# Altium schematic sheet NNP-DWG-165-001-000 BP2 Network Interface Pg 4 of 6.SchDoc
size 431 x 279 mm; Organization: ORGANIZATION; Address1: ADDRESS 1; Address2: ADDRESS 2; Address3: ADDRESS 3; Address4: ADDRESS 4; Revision: -; SheetNumber: 5; SheetTotal: 6; ENG_APP_DATE: --/--/--; DSN_APP_DATE: --/--/--; CHK_APP_DATE: --/--/--
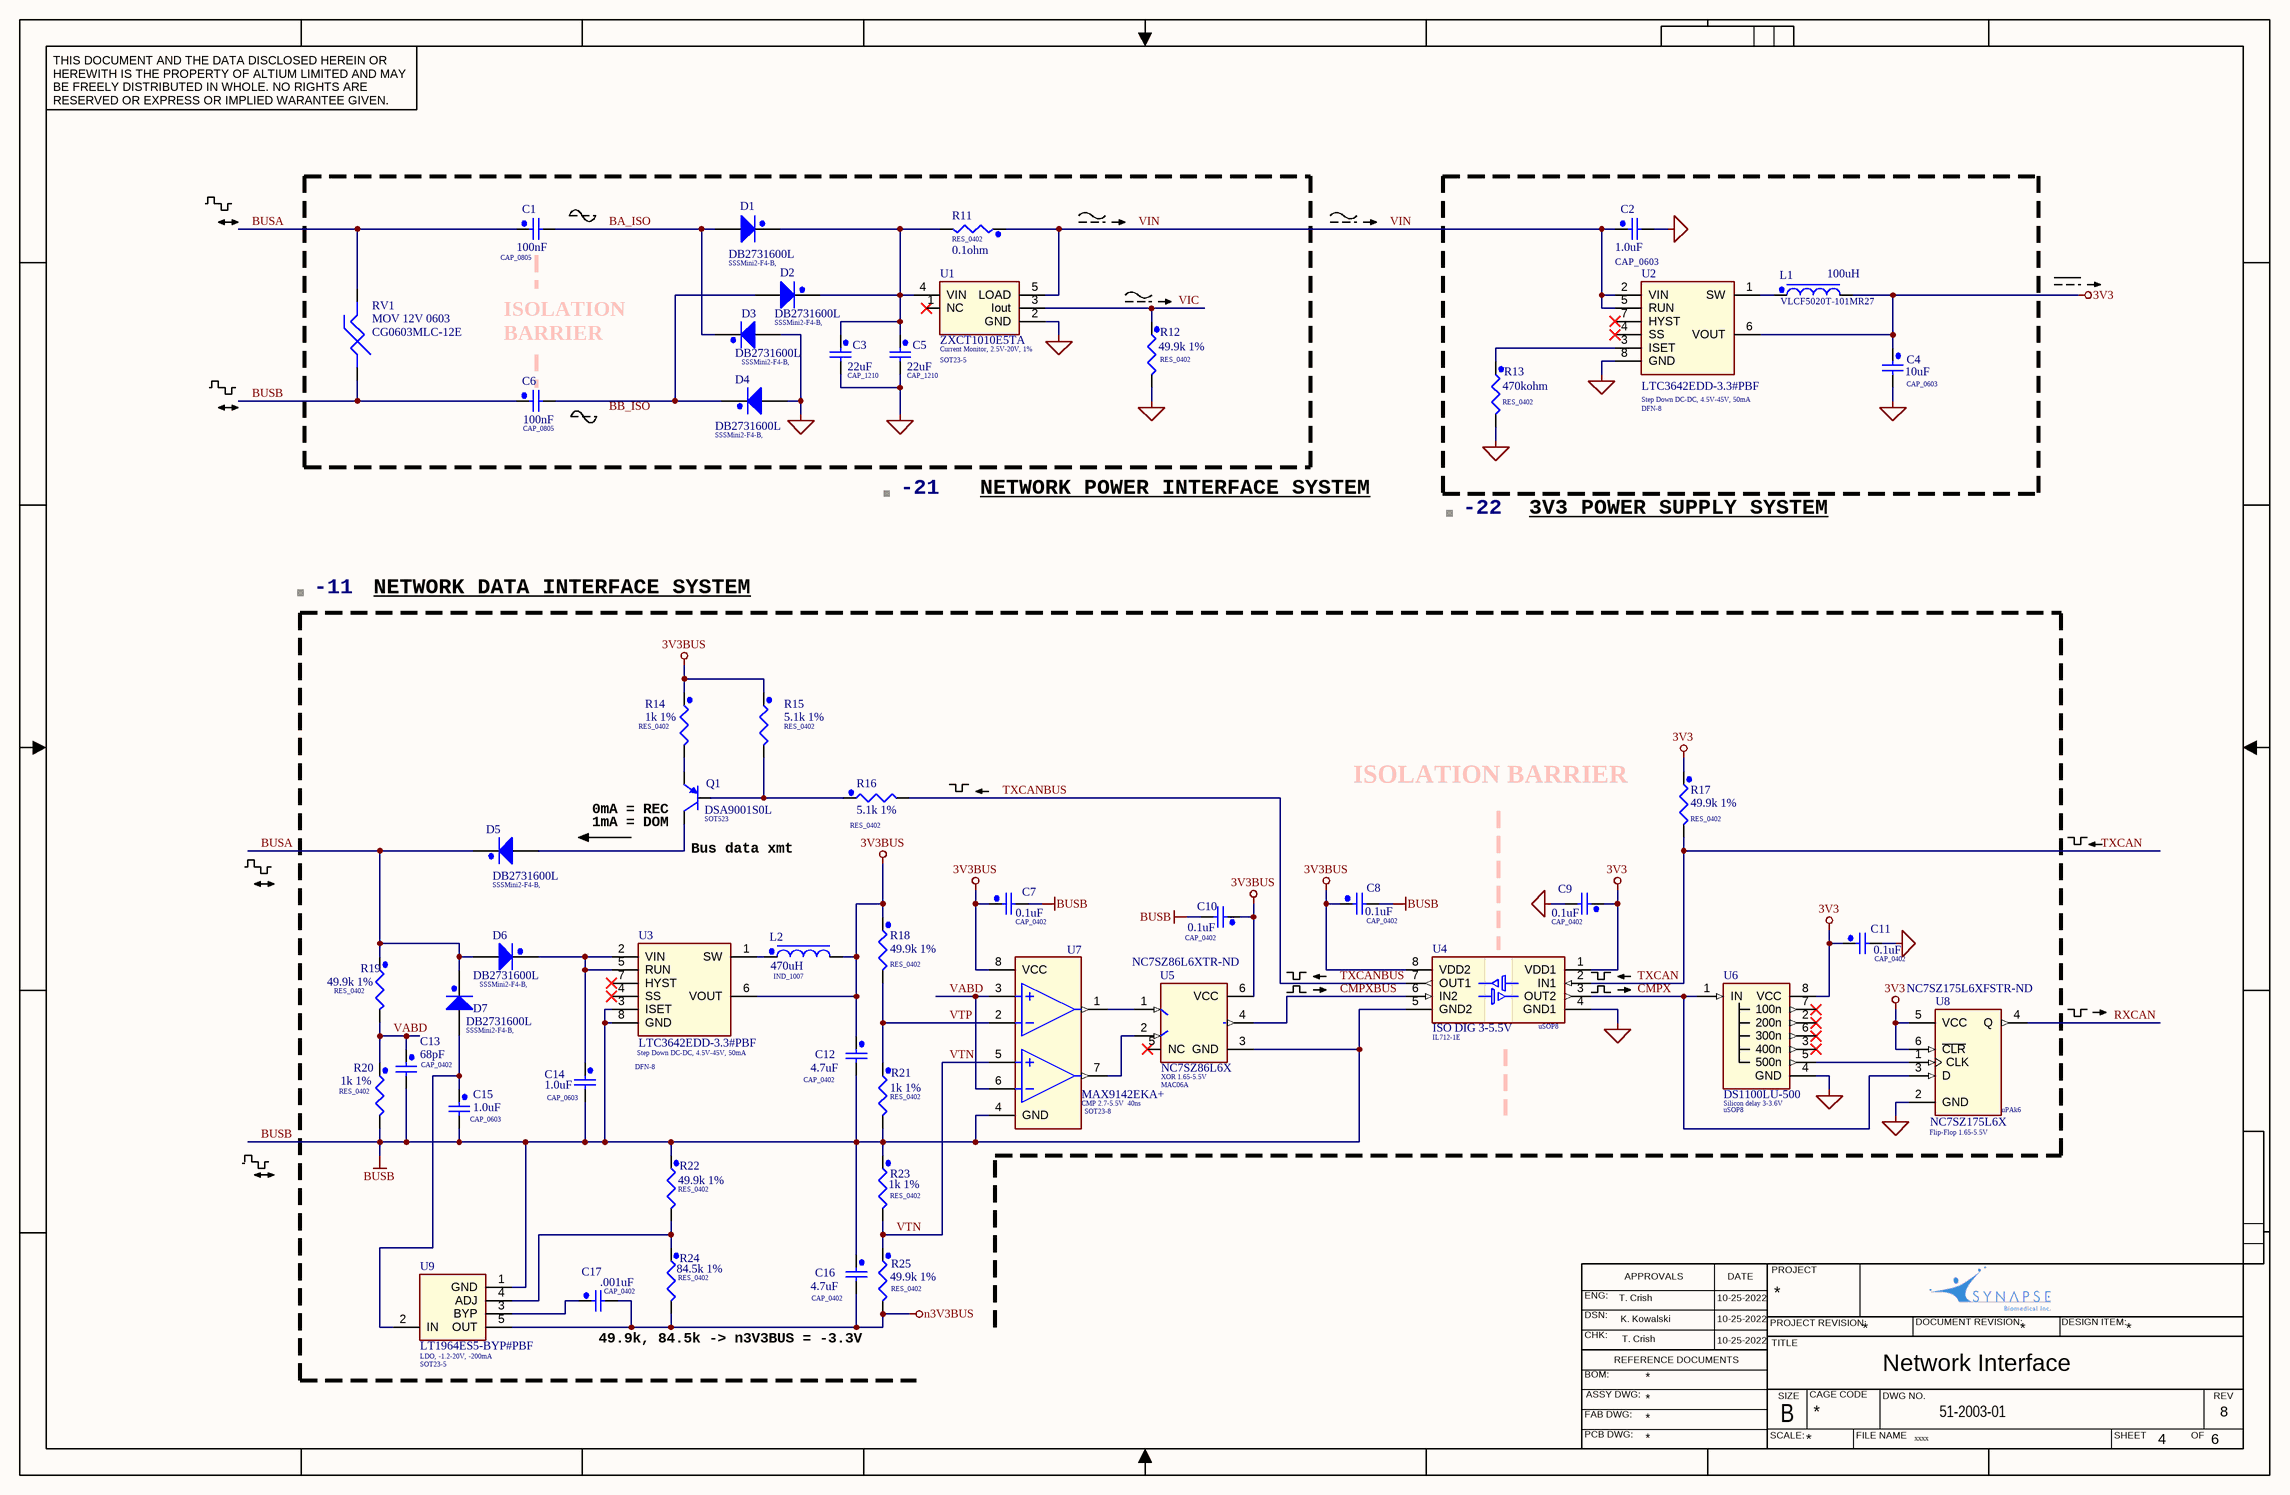
[diagram p0: NNP-DWG-165-001-000 BP2 Network Interface Pg 4 of 6.SchDoc]

## Parts
-11  XDESCRIPTION: NETWORK DATA INTERFACE SYSTEM  (hidden comment: BOM_S1)  (graphical)
-21  XDESCRIPTION: NETWORK POWER INTERFACE SYSTEM  (hidden comment: BOM_S1)  (graphical)
-22  XDESCRIPTION: 3V3 POWER SUPPLY SYSTEM  (hidden comment: BOM_S1)  (graphical)
C1  value 100nF  [CAP_0805]  (hidden comment: C_100n_X7R_100_0805_10%)
C2  value 1.0uF  [CAP_0603]  (hidden comment: C_1u_X7R_25_0603_10%)
C3  value 22uF  PackageDescription: CAP_1210  [CHIP_1210N]  (hidden comment: C_47u_X5R_16_1210_20%)
C4  value 10uF  [CAP_0603]  (hidden comment: C_10u_X5R_6V3_0603_20%)
C5  value 22uF  PackageDescription: CAP_1210  [CHIP_1210N]  (hidden comment: C_47u_X5R_16_1210_20%)
C6  value 100nF  [CAP_0805]  (hidden comment: C_100n_X7R_100_0805_10%)
C7  value 0.1uF  [CAP_0402]  (hidden comment: C_100n_X7R_16_0402_10%)
C8  value 0.1uF  [CAP_0402]  (hidden comment: C_100n_X7R_16_0402_10%)
C9  value 0.1uF  [CAP_0402]  (hidden comment: C_100n_X7R_16_0402_10%)
C10  value 0.1uF  [CAP_0402]  (hidden comment: C_100n_X7R_16_0402_10%)
C11  value 0.1uF  [CAP_0402]  (hidden comment: C_100n_X7R_16_0402_10%)
C12  value 4.7uF  [CAP_0402]  (hidden comment: C_4u7_X5R_6V3_0402_20%)
C13  value 68pF  [CAP_0402]  (hidden comment: C_68p_C0G_50_0402_5%)
C14  value 1.0uF  [CAP_0603]  (hidden comment: C_1u_X7R_25_0603_10%)
C15  value 1.0uF  [CAP_0603]  (hidden comment: C_1u_X7R_25_0603_10%)
C16  value 4.7uF  [CAP_0402]  (hidden comment: C_4u7_X5R_6V3_0402_20%)
C17  value .001uF  [CAP_0402]  (hidden comment: C_10n_X7R_50_0402_20%)
D1  value DB2731600L  PackageDescription: SSSMini2-F4-B,  [SSSMini2-F4-B]  (hidden comment: Schotty Diode, 30V, 100mA, RoHS)
D2  value DB2731600L  PackageDescription: SSSMini2-F4-B,  [SSSMini2-F4-B]  (hidden comment: Schotty Diode, 30V, 100mA, RoHS)
D3  value DB2731600L  PackageDescription: SSSMini2-F4-B,  [SSSMini2-F4-B]  (hidden comment: Schotty Diode, 30V, 100mA, RoHS)
D4  value DB2731600L  PackageDescription: SSSMini2-F4-B,  [SSSMini2-F4-B]  (hidden comment: Schotty Diode, 30V, 100mA, RoHS)
D5  value DB2731600L  PackageDescription: SSSMini2-F4-B,  [SSSMini2-F4-B]  (hidden comment: Schotty Diode, 30V, 100mA, RoHS)
D6  value DB2731600L  PackageDescription: SSSMini2-F4-B,  [SSSMini2-F4-B]  (hidden comment: Schotty Diode, 30V, 100mA, RoHS)
D7  value DB2731600L  PackageDescription: SSSMini2-F4-B,  [SSSMini2-F4-B]  (hidden comment: Schotty Diode, 30V, 100mA, RoHS)
L1  value 100uH  [IND LPS4414 COILCRAFT]  (hidden comment: L_100u, 270mA, 20%, RoHS)
L2  value 470uH  [IND_1007]  (hidden comment: 470uH, 35mH, 10%, 10 ohm)
Q1  value DSA9001S0L  [SOT523]  (hidden comment: Q_-50_-100m_SOT523)
R11  value 0.1ohm  [RES_0402]  (hidden comment: R_100m_0402)
R12  value 49.9k 1%  [RES_0402]  (hidden comment: R_49k9_0402)
R13  value 470kohm  [RES_0402]  (hidden comment: R_470k_0402)
R14  value 1k 1%  [RES_0402]  (hidden comment: R_1k_0402)
R15  value 5.1k 1%  [RES_0402]  (hidden comment: R_5k1_0402)
R16  value 5.1k 1%  [RES_0402]  (hidden comment: R_5k1_0402)
R17  value 49.9k 1%  [RES_0402]  (hidden comment: R_49k9_0402)
R18  value 49.9k 1%  [RES_0402]  (hidden comment: R_49k9_0402)
R19  value 49.9k 1%  [RES_0402]  (hidden comment: R_49k9_0402)
R20  value 1k 1%  [RES_0402]  (hidden comment: R_1k_0402)
R21  value 1k 1%  [RES_0402]  (hidden comment: R_1k_0402)
R22  value 49.9k 1%  [RES_0402]  (hidden comment: R_49k9_0402)
R23  value 1k 1%  [RES_0402]  (hidden comment: R_1k_0402)
R24  value 84.5k 1%  [RES_0402]  (hidden comment: R_84k5_0402)
R25  value 49.9k 1%  [RES_0402]  (hidden comment: R_49k9_0402)
RV1  MOV 12V 0603  [RES_0603]
U1  Current Monitor, 2.5V-20V, 1%  [SOT23-5]
U2  Step Down DC-DC, 4.5V-45V, 50mA  PackageDescription: DFN-8  MPN: LTC3642EDD-3.3#PBF  [DFN8]
U3  Step Down DC-DC, 4.5V-45V, 50mA  PackageDescription: DFN-8  MPN: LTC3642EDD-3.3#PBF  [DFN8]
U4  ISO DIG 3-5.5V  PackageDescription: uSOP8  [MSOP-8L]
U5  XOR 1.65-5.5V  PackageDescription: MAC06A  Supplier Part Number 1: NC7SZ86L6XTR-ND  [uPak6]
U6  Silicon delay 3-3.6V  PackageDescription: uSOP8  [MSOP-8L]
U7  CMP 2.7-5.5V  40ns  MPN: MAX9142EKA+  [SOT23-8]
U8  Flip-Flop 1.65-5.5V  Supplier Part Number 1: NC7SZ175L6XFSTR-ND  [uPak6]
U9  LDO, -1.2-20V, -200mA  MPN: LT1964ES5-BYP#PBF  [SOT23-5]

## Nets
3V3: C4.1 C9.1 C11.1 L1.2 R17.1 U2.6(VOUT) U4.1(VDD1) U6.8(VCC) U8.5(VCC) U8.6(~{CLR})
3V3BUS: C7.1 C8.1 C10.1 C12.1 L2.2 R14.1 R15.1 R18.1 U3.6(VOUT) U4.8(VDD2) U5.6(VCC) U7.8(VCC)
BUSB: C6.1 C7.2 C8.2 C10.2 C12.2 C13.2 C14.2 C15.2 C16.1 R20.2 R21.2 R22.1 R23.1 RV1.2(P) U3.3(ISET) U3.8(GND) U4.5(GND2) U5.3(GND) U7.4(GND) U9.1(GND)
GND: C2.2 C3.2 C4.2 C5.2 C9.2 C11.2 D3.2(A) D4.2(A) R12.2 R13.2 U1.2(GND) U2.8(GND) U4.4(GND1) U6.4(GND) U8.2(GND)
n3V3BUS: C16.2 C17.2 R24.2 R25.2 U9.5(OUT)
BA_ISO: C1.2 D1.2(A) D3.1(C)
BUSA: C1.1 D5.1(C) D6.2(A) D7.1(C) R19.1 RV1.1(P)
CMPX: U4.3(OUT2) U6.1(IN) U8.3(D)
CMPXBUS: U4.6(IN2) U5.4(O)
RXCAN: U8.4(Q)
TXCAN: R17.2 U4.2(IN1)
TXCANBUS: R16.2 U4.7(OUT1)
VABD: C13.1 R19.2 R20.1 U7.3(INA+) U7.6(INB-)
VIC: R12.1 U1.3(Iout)
VIN: C2.1 R11.1 U1.5(LOAD) U2.2(VIN) U2.5(RUN)
VTN: R23.2 R25.1 U7.5(INB+)
VTP: R18.2 R21.1 U7.2(INA-)
NetC3_1: C3.1 C5.1 D1.1(C) D2.1(C) R11.2 U1.4(VIN)
NetC6_2: C6.2 D2.2(A) D4.1(C)
NetC14_1: C14.1 D6.1(C) U3.2(VIN) U3.5(RUN)
NetC15_1: C15.1 D7.2(A) U9.2(IN)
NetC17_1: C17.1 U9.3(BYP)
NetD5_2: D5.2(A) Q1.3(C)
NetL1_1: L1.1 U2.1(SW)
NetL2_1: L2.1 U3.1(SW)
NetQ1_1: Q1.1(B) R15.2 R16.1
NetQ1_2: Q1.2(E) R14.2
NetR13_1: R13.1 U2.3(ISET)
NetR22_2: R22.2 R24.1 U9.4(ADJ)
NetU5_1: U5.1(A) U7.1(OUTA)
NetU5_2: U5.2(B) U7.7(OUTB)
NetU6_5: U6.5(500n) U8.1(CLK)

Not connected (* = marked no-connect by the designer): U1 1(NC)*; U2 4(SS)* 7(HYST)*; U3 4(SS)* 7(HYST)*; U5 5(NC)*; U6 2(200n)* 3(400n)* 6(300n)* 7(100n)*

## Notes on the sheet
- THIS DOCUMENT AND THE DATA DISCLOSED HEREIN OR HEREWITH IS THE PROPERTY OF ALTIUM LIMITED AND MAY BE FREELY DISTRIBUTED IN WHOLE. NO RIGHTS ARE RESERVED OR EXPRESS OR IMPLIED WARANTEE GIVEN.
- ISOLATION
  BARRIER
- (near Q1) 0mA = REC
- (near Q1) 1mA = DOM
- ISOLATION BARRIER
- (near Q1) Bus data xmt
- ENG:
- T. Crish
- APPROVALS
- 10-25-2022
- DATE
- PROJECT
- 49.9k, 84.5k -> n3V3BUS = -3.3V
- DSN:
- CHK:
- REFERENCE DOCUMENTS
- K. Kowalski
- PROJECT REVISION:
- TITLE
- *
- DOCUMENT REVISION:
- Network Interface
- DESIGN ITEM:
- BOM:
- FAB DWG:
- PCB DWG:
- ASSY DWG:
- SCALE:
- SIZE
- B
- CAGE CODE
- FILE NAME
- DWG NO.
- 51-2003-01
- SHEET
- OF
- REV
- 8
- xxxx
- 4
- 6
- Labels drawn without touching a wire or pin: BB_ISO

## Library data of the parts
-11 -21 -22 = BOM_S1: BOM item small graphic
C1 C6 = 08051C104KAZ2A: 0.1uF, 100V, X7R, 0805, 10%, RoHS; MFR: Murata Electronics North America; MPN: GRM155R71C104KA88D; SBI: xx-xxxx; PackageDescription: CAP_0805; Supplier 1: Digi-Key; Supplier Part Number 1: 490-3261-6-ND
C2 C14 = GRM188R71E105KA12D: 1.0uF, 25V, X7R, 0603, 10%, RoHs; MFR: TDK Corp; MPN: CGA3E1X7R1C105K080AC; SBI: 53-0067; PackageDescription: CAP_0603; Supplier 1: Digi-Key; Supplier Part Number 1: 445-12539
C3 C5 = GRM32ER61C476ME15L: 22uF, 16V, X5R, 1210, 20%, RoHS; MFR: Samsung Electro-Mechanics America; MPN: CL32A226MOTLNNE; SBI: 53-0099; Supplier 1: Digi-Key; Supplier Part Number 1: 1276-6757-1-ND
C4 = ECJ-1VB0J106M: 10uF, 6.3V, X5R, 0603_20%, RoHS; MFR: Murata Electronics North America; SBI: 53-0039; PackageDescription: CAP_0603; Supplier 1: Digi-Key; Supplier Part Number 1: 490-6405-6-ND; MPN: GRM188R60J106ME47J
C7-C11 = GRM155R71C104KA88D: 0.1uF, 16V, X7R, 0402, RoHS; MFR: Murata Electronics North America; SBI: 53-0040; PackageDescription: CAP_0402; Supplier 1: Digi-Key; Supplier Part Number 1: 490-3261-6-ND; MPN: GRM155R71C104KA88D
C12 C16 = ECJ-0EB0J475M: 4.7uF, 6.3V, X5R, 20%, 0402, RoHS; MFR: Murata Electronics North America; MPN: GRM155R60J475ME47D; SBI: 53-0042; VTPN: CC6470-MJA06R16; PackageDescription: CAP_0402; Supplier 1: Digi-Key; Supplier Part Number 1: 490-5915-6-ND
C13 = GRM1555C1H680JZ01D: 68pF, 50V, C0G, 0402, 5%, RoHS; MFR: Murata Electronics  North America; MPN: GRM1555C1H680JA01D; SBI: 53-0041-1; PackageDescription: CAP_0402; Supplier 1: Digi-Key; Supplier Part Number 1: 490-5876-6-ND
C15 = GRM188R71E105KA12D: 1.0uF, 25V, X7R, 0603, 10%, RoHs; MFR: TDK Corp; MPN: CGA3E1X7R1C105K080AC; PackageDescription: CAP_0603; Supplier 1: Digi-Key; Supplier Part Number 1: 445-12539
C17 = C0402C103M5RACTU: 0.001uF, 50V, X7R, 20%, 0402, RoHS; MFR: Murata Electronics North America; MPN: GJM1555C1H1R0BB01D; SBI: 53-0043; VTPN: CC4100-MJX50RC7; PackageDescription: CAP_0402; Supplier 1: Digi-Key; Supplier Part Number 1: 490-6073-6-ND
D1-D7 = DB27316: MFR: Panasonic Electronic Components; SBI: 54-0075; Supplier 1: Digi-Key; Supplier Part Number 1: DB2731600LDKR-ND; MPN: DB2731600L
L1 = VLCF5020T-101MR27: MFR: TDK Corporation; SBI: 53-0032; MPN: VLCF5020T-101MR27; Supplier 1: Digi-Key; Supplier Part Number 1: 445-3203-6-ND
L2 = CB2518T471K: 470uH, 35mA, 10%, RoHS; MFR: Taiyo Yuden; SBI: 55-0033; VTPN: IS5470-K000RC7; Supplier 1: Digi-Key; PackageDescription: IND_1007; Supplier Part Number 1: 587-2194-6-ND; MPN: CB2518T471K
Q1 = DSA9001: PNP, -50V, -100mA, SOT523, 150MHz, RoHS; MFR: Panasonic; SBI: 54-0050; VTPN: TSDSA900-S0RC7; PackageDescription: SOT523; Supplier 1: Digi-Key; Supplier Part Number 1: DSA9001S0LDKR-ND; MPN: DSA9001S0L
R11 = RP1005S-R10-F: 0.1 ohm, 1%, 1/16W, 0402, RoHS; MFR: Susumu; SBI: 53-0049-2; PackageDescription: RES_0402; Supplier 1: Digi-Key; Supplier Part Number 1: RP10S.10FCT-ND; MPN: RP1005S-R10-F
R12 R17-R19 R25 = MCR01MZPF4992: 49.9k ohm, 1%, 1/16W, 0402, RoHS; MFR: Vishay Dale; MPN: CRCW040249K9FKED; SBI: 53-0049-2; PackageDescription: RES_0402; Supplier 1: Digi-Key; Supplier Part Number 1: 541-49.9KLCT-ND
R13 = ERJ-2RKF4703X: 470k ohm, 1% , 1/16W, smd, 0402, RoHS; MFR: Vishay Dale; MPN: CRCW0402470KFKED; SBI: 53-0049-3; PackageDescription: RES_0402; Supplier 1: Digi-Key; Supplier Part Number 1: 541-470KLCT-ND
R14 R20 R21 R23 = MCR01MZPF1001: 1.0k ohm, 1%, 1/16W, smd, 0402, RoHS; MFR: Vishay Dale; MPN: CRCW04021K00FKED; SBI: 54-0049-4; PackageDescription: RES_0402; Supplier 1: Digi-Key; Supplier Part Number 1: 541-1.00KLCT-ND
R15 R16 = MCR01MZPF5101: 5.1K ohm, 1%, 1/16W, smd, 0402, RoHS; MFR: Vishay Dale; MPN: CRCW04025K10FKED; SBI: 53-0049-5; PackageDescription: RES_0402; Supplier 1: Digi-Key; Supplier Part Number 1: 541-5.10KLCT-ND
R22 = MCR01MZPF4992: 49.9k ohm, 1%, 1/16W, 0402, RoHS; MFR: Vishay Dale; MPN: CRCW040249K9FKED; VTPN: RC4499-FI006RC9; SBI: 53-0049-2; NNPN: 00-11-1455; PackageDescription: RES_0402; Supplier 1: Digi-Key; Supplier Part Number 1: 541-49.9KLCT-ND
R24 = ERJ-2RKF8452X: 84.5k ohm, 1%, 1/10W, 0402, RoHS; MFR: Vishay Dale; MPN: CRCW040284K5FKED; VTPN: RC4845-FI006RC7; SBI: 53-0051; NNPN: 00-11-1477; PackageDescription: RES_0402; Supplier 1: Digi-Key; Supplier Part Number 1: 541-84.5KLCT-ND
RV1 = CG0603MLC-12E: MOV, 12V, 0603, RoHS; MFR: Bourns; SBI: 53-0066; PackageDescription: 0603; Value: 12V; MPN: CG0603MLC-12E; Supplier 1: Digi-Key; Supplier Part Number 1: CG0603MLC-12ETR-ND
U1 = ZXCT1010E5TA: Current Monitor, 2.5V-20V, 1%, RoHS; MFR: Zetex; SBI: 54-0052; ComponentLink1URL: Q:\00\04\00-04-3500 Zetex ZXCT1010.pdf; NNPN: 00-04-3500; PackageDescription: SOT23-5; Supplier 1: Digi-Key; Supplier Part Number 1: ZXCT1010CT-ND; MPN: ZXCT1010E5TA
U2 = LTC3642EDD: Step Down DC-DC, 4.5V-45V, 50mA, RoHS; MFR: Linear Technology; SBI: 54-0053; Note: VOUT=3.3V; Supplier 1: Digi-Key; Supplier Part Number 1: LTC3642EDD-3.3#PBF-ND
U3 = LTC3642EDD: Step Down DC-DC, 4.5V-45V, 50mA, RoHS; MFR: Linear Technology; SBI: 54-0053; Note: VOUT=3.3V; VTPN: ELRLTC364-SRC7; Supplier 1: Digi-Key; Supplier Part Number 1: LTC3642EDD-3.3#PBF-ND
U4 = IL712-1E: Digital Isolator, 3-5.5V, uSOP8, RoHS; MFR: NVE; SBI: 54-0056; Supplier 1: Digi-Key; Supplier Part Number 1: 390-1105-5-ND; MPN: IL712-1E
U5 = NC7SZ86L6X: XOR, 1.65-5.5V, uPAK6, RoHS; MFR: Fairchild; SBI: 54-0055; ComponentLink1URL: Q:\00\04\00-04-1016 Fairchild NC7SZ86.pdf; MPN: NC7SZ86L6X; Supplier 1: Digi-Key
U6 = DS1100LU-500: Silicon delay,  3-3.6V, uSOP8, RoHS; MFR: Maxim; SBI: 54-0057; Value: *; MPN: DS1100LU-500; Supplier 1: Digi-Key; Supplier Part Number 1: DS1100LU-500+-ND
U7 = MAX9142EKA: Comparator, 2.7-5.5V, 40nS, SOT23-8, RoHS; MFR: Maxim; SBI: 54-0054; PackageDescription: SOT23-8; Supplier 1: Digi-Key; Supplier Part Number 1: MAX9142EKA+TCT-ND
U8 = NC7SZ175L6X: FLIPFLOP, 1.65-5.5V, uPAk6, RoHS; MFR: Fairchild; SBI: 54-0058; ComponentLink1URL: Q:\00\04\00-04-1007 Fairchild NC7SZ175.pdf; PackageDescription: uPAk6; MPN: NC7SZ175L6X; Supplier 1: Digi-Key
U9 = LT1964ES5-BYP: Low Droupout negative regulator, -5V, -200mA; MFR: Linear Technology; SBI: 53-0059; PackageDescription: SOT23-5; Supplier 1: Digi-Key; Supplier Part Number 1: LT1964ES5-BYP#TRMPBFCT-ND